# Altium schematic sheet pcuPWR.SchDoc
size A3
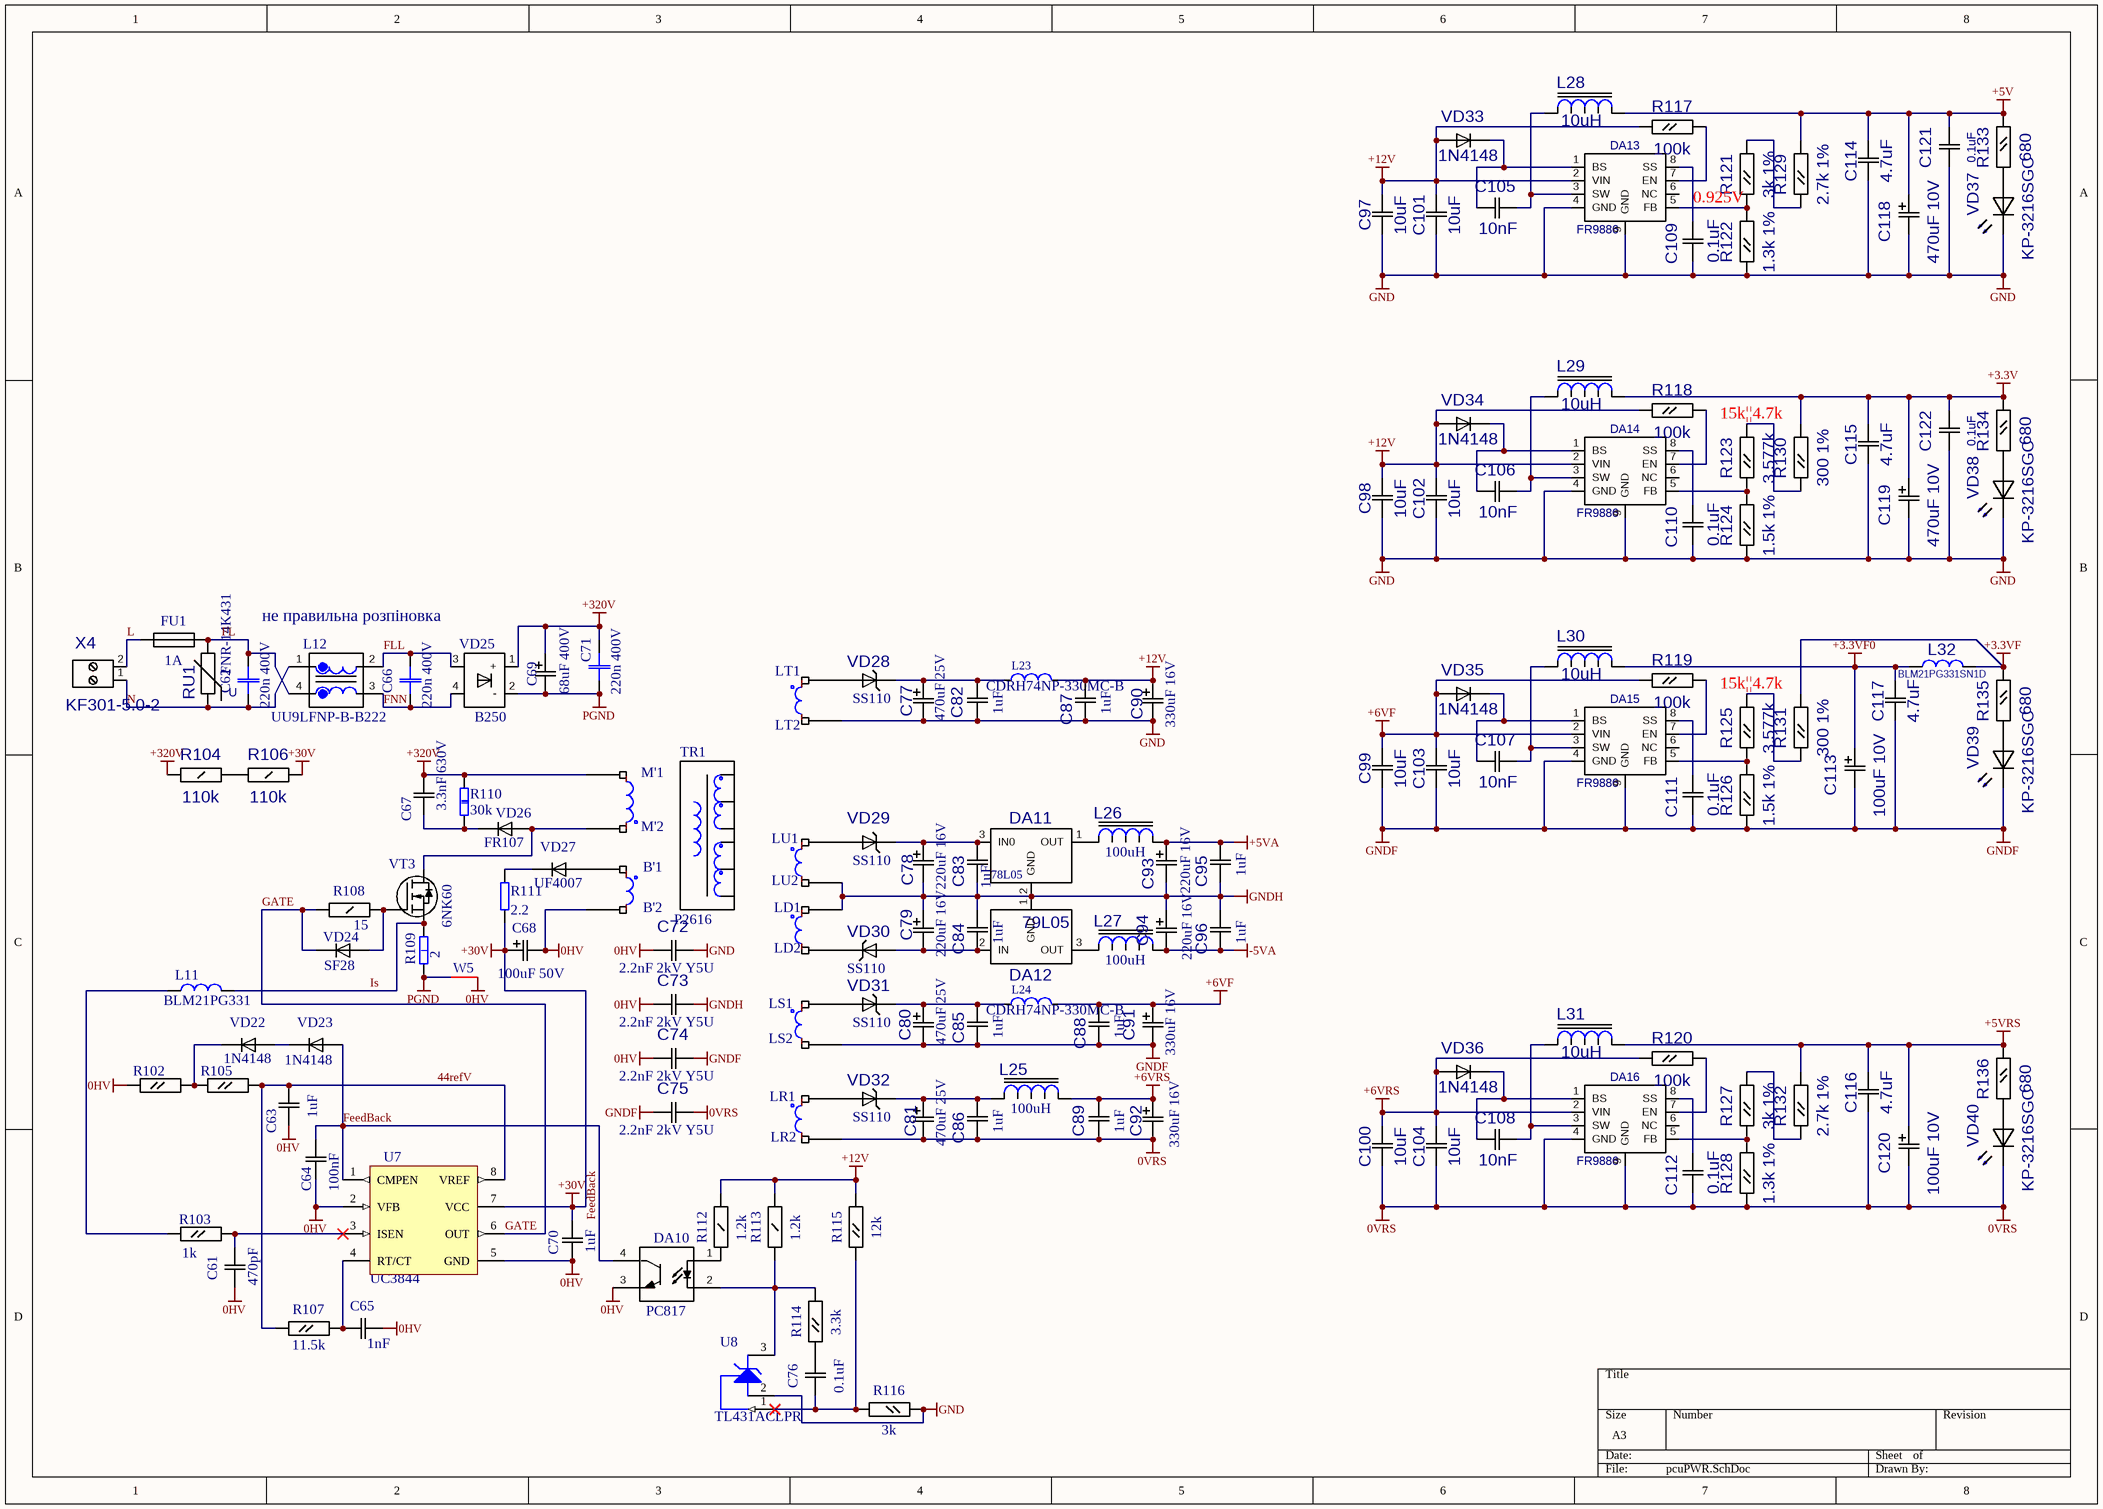
[diagram p0: pcuPWR.SchDoc]

## Parts
B'1  PCB_1R  [PCB_1R_BigOval]  (value not drawn)
B'2  PCB_1R  [PCB_1R_BigOval]  (value not drawn)
C61  value 470pF  [C0805]  (hidden comment: C0805)
C62  220n 400V  [MKP 18x7 h14 R15.24]
C63  value 1uF  [C0805]  (hidden comment: C0805)
C64  value 100nF  [C0805]  (hidden comment: C0805)
C65  value 1nF  [C0805]  (hidden comment: C0805)
C66  220n 400V  [MKP 18x7 h14 R15.24]
C67  3.3nF 630V  [Cer-Disk-d12.5-R7.62]
C68  value 100uF 50V  [El-d8-h12-F3.81]  (hidden comment: Cap El)
C69  value 68uF 400V  [El-d18-h36-F7.62]  (hidden comment: Cap El)
C70  value 1uF  [C0805]  (hidden comment: C0805)
C71  220n 400V  [MKP 18x7 h14 R15.24]
C72  2.2nF 2kV Y5U  [Cap-Disk-d8.5-R5.08]
C73  2.2nF 2kV Y5U  [Cap-Disk-d8.5-R5.08]
C74  2.2nF 2kV Y5U  [Cap-Disk-d8.5-R5.08]
C75  2.2nF 2kV Y5U  [Cap-Disk-d8.5-R5.08]
C76  value 0.1uF  [C0805]  (hidden comment: C0805)
C77  value 470uF 25V  [El-d8-h12-F3.81]  (hidden comment: Cap El)
C78  value 220uF 16V  [El-d6.3-h13-F2.54]  (hidden comment: Cap El)
C79  value 220uF 16V  [El-d6.3-h13-F2.54]  (hidden comment: Cap El)
C80  value 470uF 25V  [El-d8-h12-F3.81]  (hidden comment: Cap El)
C81  value 470uF 25V  [El-d8-h12-F3.81]  (hidden comment: Cap El)
C82  value 1uF  [C0805]  (hidden comment: C0805)
C83  value 1uF  [C0805]  (hidden comment: C0805)
C84  value 1uF  [C0805]  (hidden comment: C0805)
C85  value 1uF  [C0805]  (hidden comment: C0805)
C86  value 1uF  [C0805]  (hidden comment: C0805)
C87  value 1uF  [C0805]  (hidden comment: C0805)
C88  value 1uF  [C0805]  (hidden comment: C0805)
C89  value 1uF  [C0805]  (hidden comment: C0805)
C90  value 330uF 16V  [El-d8-h12-F3.81]  (hidden comment: Cap El)
C91  value 330uF 16V  [El-d8-h12-F3.81]  (hidden comment: Cap El)
C92  value 330uF 16V  [El-d8-h12-F3.81]  (hidden comment: Cap El)
C93  value 220uF 16V  [El-d6.3-h13-F2.54]  (hidden comment: Cap El)
C94  value 220uF 16V  [El-d6.3-h13-F2.54]  (hidden comment: Cap El)
C95  value 1uF  [C0805]  (hidden comment: C0805)
C96  value 1uF  [C0805]  (hidden comment: C0805)
C97  value 10uF  [C1206]  (hidden comment: C1206)
C98  value 10uF  [C1206]  (hidden comment: C1206)
C99  value 10uF  [C1206]  (hidden comment: C1206)
C100  value 10uF  [C1206]  (hidden comment: C1206)
C101  value 10uF  [C1206]  (hidden comment: C1206)
C102  value 10uF  [C1206]  (hidden comment: C1206)
C103  value 10uF  [C1206]  (hidden comment: C1206)
C104  value 10uF  [C1206]  (hidden comment: C1206)
C105  value 10nF  [C0805]  (hidden comment: C0805)
C106  value 10nF  [C0805]  (hidden comment: C0805)
C107  value 10nF  [C0805]  (hidden comment: C0805)
C108  value 10nF  [C0805]  (hidden comment: C0805)
C109  value 0.1uF  [C0805]  (hidden comment: C0805)
C110  value 0.1uF  [C0805]  (hidden comment: C0805)
C111  value 0.1uF  [C0805]  (hidden comment: C0805)
C112  value 0.1uF  [C0805]  (hidden comment: C0805)
C113  value 100uF 10V  [El-d5-h11-F2.54]  (hidden comment: Cap El)
C114  value 4.7uF  [C1206]  (hidden comment: C1206)
C115  value 4.7uF  [C1206]  (hidden comment: C1206)
C116  value 4.7uF  [C1206]  (hidden comment: C1206)
C117  value 4.7uF  [C1206]  (hidden comment: C1206)
C118  value 470uF 10V  [El-d8-h12-F3.81]  (hidden comment: Cap El)
C119  value 470uF 10V  [El-d8-h12-F3.81]  (hidden comment: Cap El)
C120  value 100uF 10V  [El-d5-h11-F2.54]  (hidden comment: Cap El)
C121  value 0.1uF  [C0805]  (hidden comment: C0805)
C122  value 0.1uF  [C0805]  (hidden comment: C0805)
DA10  PC817  [DIL4-300a]
DA11  78L05  [TO-92 - 1-2-3]
DA12  79L05  [TO-92 - 1-2-3]
DA13  FR9886  [SO8TP]
DA14  FR9886  [SO8TP]
DA15  FR9886  [SO8TP]
DA16  FR9886  [SO8TP]
FU1  value 1A  [FU_5x15]  (hidden comment: FUSE-D5)
L11  BLM21PG331  [R0805]
L12  UU9LFNP-B-B222  [UU9LF]
L23  CDRH74NP-330MC-B  [Dr-DRH-74]
L24  CDRH74NP-330MC-B  [Dr-DRH-74]
L25  100uH  [CD54]
L26  100uH  [CD54]
L27  100uH  [CD54]
L28  10uH  [CD32]
L29  10uH  [CD32]
L30  10uH  [CD32]
L31  10uH  [CD32]
L32  BLM21PG331SN1D  [R0805]
LD1  PCB_1R  [PCB_1R_BigOval]  (value not drawn)
LD2  PCB_1R  [PCB_1R_BigOval]  (value not drawn)
LR1  PCB_1R  [PCB_1R_BigOval]  (value not drawn)
LR2  PCB_1R  [PCB_1R_BigOval]  (value not drawn)
LS1  PCB_1R  [PCB_1R_BigOval]  (value not drawn)
LS2  PCB_1R  [PCB_1R_BigOval]  (value not drawn)
LT1  PCB_1R  [PCB_1R_BigOval]  (value not drawn)
LT2  PCB_1R  [PCB_1R_BigOval]  (value not drawn)
LU1  PCB_1R  [PCB_1R_BigOval]  (value not drawn)
LU2  PCB_1R  [PCB_1R_BigOval]  (value not drawn)
M'1  PCB_1R  [PCB_1R_BigOval]  (value not drawn)
M'2  PCB_1R  [PCB_1R_BigOval]  (value not drawn)
R102  R0805  [R0805]  (value not drawn)
R103  value 1k  [R0805]  (hidden comment: R0805)
R104  value 110k  [R1206]  (hidden comment: R1206)
R105  R0805  [R0805]  (value not drawn)
R106  value 110k  [R1206]  (hidden comment: R1206)
R107  value 11.5k  [R0805]  (hidden comment: R0805)
R108  value 15  [R1206]  (hidden comment: R1206)
R109  2  [R1W CF-500]
R110  30k  [R3W MO-700]
R111  2.2  [R0.25-300]
R112  value 1.2k  [R1206]  (hidden comment: R1206)
R113  value 1.2k  [R1206]  (hidden comment: R1206)
R114  value 3.3k  [R0805]  (hidden comment: R0805)
R115  value 12k  [R0805]  (hidden comment: R0805)
R116  value 3k  [R0805]  (hidden comment: R0805)
R117  value 100k  [R0805]  (hidden comment: R0805)
R118  value 100k  [R0805]  (hidden comment: R0805)
R119  value 100k  [R0805]  (hidden comment: R0805)
R120  value 100k  [R0805]  (hidden comment: R0805)
R121  value 3k 1%  [R0805]  (hidden comment: R0805)
R122  value 1.3k 1%  [R0805]  (hidden comment: R0805)
R123  value 3.577k  [R0805]  (hidden comment: R0805)
R124  value 1.5k 1%  [R0805]  (hidden comment: R0805)
R125  value 3.577k  [R0805]  (hidden comment: R0805)
R126  value 1.5k 1%  [R0805]  (hidden comment: R0805)
R127  value 3k 1%  [R0805]  (hidden comment: R0805)
R128  value 1.3k 1%  [R0805]  (hidden comment: R0805)
R129  value 2.7k 1%  [R0805]  (hidden comment: R0805)
R130  value 300 1%  [R0805]  (hidden comment: R0805)
R131  value 300 1%  [R0805]  (hidden comment: R0805)
R132  value 2.7k 1%  [R0805]  (hidden comment: R0805)
R133  value 680  [R0805]  (hidden comment: R0805)
R134  value 680  [R0805]  (hidden comment: R0805)
R135  value 680  [R0805]  (hidden comment: R0805)
R136  value 680  [R0805]  (hidden comment: R0805)
RU1  value FNR-14K431  [VAR_D15_t5]  (hidden comment: VAR593)
TR1  P2616  [P2616]
U7  UC3844  [SO8-1.27]
U8  TL431ACLPR  [TI-LP3]
VD22  value 1N4148  [SOD123]  (hidden comment: DIOD_thin)
VD23  value 1N4148  [SOD123]  (hidden comment: DIOD_thin)
VD24  value SF28  [DIOD_small_bigholes]  (hidden comment: DIOD)
VD25  B250  [CS30D]
VD26  value FR107  [DIOD_small_bigholes]  (hidden comment: DIOD)
VD27  value UF4007  [DIOD_small_bigholes]  (hidden comment: DIOD)
VD28  value SS110  [DO-214AC(SMA)]  (hidden comment: 10BQ100)
VD29  value SS110  [DO-214AC(SMA)]  (hidden comment: 10BQ100)
VD30  value SS110  [DO-214AC(SMA)]  (hidden comment: 10BQ100)
VD31  value SS110  [DO-214AC(SMA)]  (hidden comment: 10BQ100)
VD32  value SS110  [DO-214AC(SMA)]  (hidden comment: 10BQ100)
VD33  value 1N4148  [SOD123]  (hidden comment: DIOD_thin)
VD34  value 1N4148  [SOD123]  (hidden comment: DIOD_thin)
VD35  value 1N4148  [SOD123]  (hidden comment: DIOD_thin)
VD36  value 1N4148  [SOD123]  (hidden comment: DIOD_thin)
VD37  KP-3216SGC  [KP-3216]
VD38  KP-3216SGC  [KP-3216]
VD39  KP-3216SGC  [KP-3216]
VD40  KP-3216SGC  [KP-3216]
VT3  value 6NK60  [TO220-RB-600]  (hidden comment: IRF620)
W5  Net connector  [Net connector0.5mm]  (value not drawn)  (net tie, no BOM)
X4  KF301-5.0-2  [KF301-5.0-2]

## Nets
0HV: B'2.1 C61.1 C63.1 C64.1 C65.2 C68.2 C70.1 C72.1 C73.1 C74.1 DA10.3(E) R102.2 U7.2(VFB) U7.5(GND) W5.1
0VRS: C75.2 C81.2 C86.1 C89.1 C92.2 C100.1 C104.1 C112.1 C116.1 C120.2 DA16.4(GND) DA16.9(GND) LR2.1 R128.2 VD40.2
+3.3V: C115.2 C119.1 C122.2 L29.2 R130.1 R134.2
+3.3VF: L32.2 R131.1 R135.2
+3.3VF0: C113.1 C117.2 L30.2 L32.1
+5V: C114.2 C118.1 C121.2 L28.2 R129.1 R133.2
+5VA: C93.1 C95.2 L26.2
+5VRS: C116.2 C120.1 L31.2 R132.1 R136.2
+6VF: C88.2 C91.1 C99.2 C103.2 DA15.2(VIN) L24.2 R119.2 VD35.2(+)
+6VRS: C89.2 C92.1 C100.2 C104.2 DA16.2(VIN) L25.2 R120.2 VD36.2(+)
+12V: C87.2 C90.1 C97.2 C98.2 C101.2 C102.2 DA13.2(VIN) DA14.2(VIN) L23.2 R112.1 R113.1 R115.1 R117.2 R118.2 VD33.2(+) VD34.2(+)
+30V: C68.1 C70.2 R106.1 R111.1 U7.7(VCC)
+320V: C67.1 C69.1 C71.1 M'1.1 R104.2 R110.2 VD25.1(+)
-5VA: C94.2 C96.1 L27.2
GND: C72.2 C77.2 C82.1 C87.1 C90.2 C97.1 C98.1 C101.1 C102.1 C109.1 C110.1 C114.1 C115.1 C118.2 C119.2 C121.1 C122.1 DA13.4(GND) DA13.9(GND) DA14.4(GND) DA14.9(GND) LT2.1 R116.2 R122.2 R124.2 U8.2(ANODE) VD37.2 VD38.2
GNDF: C74.2 C75.1 C80.2 C85.1 C88.1 C91.2 C99.1 C103.1 C111.1 C113.2 C117.1 DA15.4(GND) DA15.9(GND) LS2.1 R126.2 VD39.2
GNDH: C73.2 C78.2 C79.1 C83.1 C84.2 C93.2 C94.1 C95.1 C96.2 DA11.2(GND) DA12.1(GND) LD1.1 LU2.1
PGND: C69.2 C71.2 R109.1 VD25.2(-) W5.2
44refV: C63.2 R105.1 R107.2 U7.8(VREF)
FeedBack: C64.2 DA10.4(C) U7.1(CMPEN) VD23.2(+)
FL: C62.1 FU1.2 L12.4 RU1.1
FLL: C66.1 L12.2 VD25.3
FNN: C66.2 L12.3 VD25.4
GATE: R108.2 U7.6(OUT) VD24.1(-)
Is: L11.2 R109.2 VT3.3(S)
L: FU1.1 X4.2
N: C62.2 L12.1 RU1.2 X4.1
NetB'1_1: B'1.1 VD27.2(+)
NetC61_2: C61.2 R103.1 U7.3(ISEN)
NetC65_1: C65.1 R107.1 U7.4(RT/CT)
NetC67_2: C67.2 R110.1 VD26.1(-)
NetC76_1: C76.1 R115.2 R116.1 U8.1(REF)
NetC76_2: C76.2 R114.2
NetC77_1: C77.1 C82.2 L23.1 VD28.1
NetC78_1: C78.1 C83.2 DA11.3(IN0) VD29.1
NetC79_2: C79.2 C84.1 DA12.2(IN) VD30.2
NetC80_1: C80.1 C85.2 L24.1 VD31.1
NetC81_1: C81.1 C86.2 L25.1 VD32.1
NetC105_1: C105.1 DA13.1(BS) VD33.1(-)
NetC105_2: C105.2 DA13.3(SW) L28.1
NetC106_1: C106.1 DA14.1(BS) VD34.1(-)
NetC106_2: C106.2 DA14.3(SW) L29.1
NetC107_1: C107.1 DA15.1(BS) VD35.1(-)
NetC107_2: C107.2 DA15.3(SW) L30.1
NetC108_1: C108.1 DA16.1(BS) VD36.1(-)
NetC108_2: C108.2 DA16.3(SW) L31.1
NetC109_2: C109.2 DA13.8(SS)
NetC110_2: C110.2 DA14.8(SS)
NetC111_2: C111.2 DA15.8(SS)
NetC112_2: C112.2 DA16.8(SS)
NetDA10_1: DA10.1(+) R112.2
NetDA10_2: DA10.2(-) R113.2 R114.1 U8.3(CATHODE)
NetDA11_1: DA11.1(OUT) L26.1
NetDA12_3: DA12.3(OUT) L27.1
NetDA13_5: DA13.5(FB) R121.2 R122.1
NetDA13_7: DA13.7(EN) R117.1
NetDA14_5: DA14.5(FB) R123.2 R124.1
NetDA14_7: DA14.7(EN) R118.1
NetDA15_5: DA15.5(FB) R125.2 R126.1
NetDA15_7: DA15.7(EN) R119.1
NetDA16_5: DA16.5(FB) R127.2 R128.1
NetDA16_7: DA16.7(EN) R120.1
NetL11_1: L11.1 R103.2
NetLD2_1: LD2.1 VD30.1
NetLR1_1: LR1.1 VD32.2
NetLS1_1: LS1.1 VD31.2
NetLT1_1: LT1.1 VD28.2
NetLU1_1: LU1.1 VD29.2
NetM'2_1: M'2.1 VD26.2(+) VT3.2(D)
NetR102_1: R102.1 R105.2 VD22.1(-)
NetR104_1: R104.1 R106.2
NetR108_1: R108.1 VD24.2(+) VT3.1(G)
NetR111_2: R111.2 VD27.1(-)
NetR121_1: R121.1 R129.2
NetR123_1: R123.1 R130.2
NetR125_1: R125.1 R131.2
NetR127_1: R127.1 R132.2
NetR133_1: R133.1 VD37.1
NetR134_1: R134.1 VD38.1
NetR135_1: R135.1 VD39.1
NetR136_1: R136.1 VD40.1
NetVD22_2: VD22.2(+) VD23.1(-)

Not connected (* = marked no-connect by the designer): DA13 6(NC); DA14 6(NC); DA15 6(NC); DA16 6(NC)

## Notes on the sheet
- (near R121) 0.925V
- 15k||4.7k
- не правильна розпіновка
- (in symbol VARISTOR_D15) U

## Library data of the parts
C61 C63-C65 C70 C76 C82-C89 C95 C96 C121 C122 = C0805: RefDes2: {RefDes2}
C62 C66 C71 = MKS4 220n 400V: Value: 220n 400V
C67 C72-C75 = Cap: CBB21; RefDes2: {RefDes2}
C68 C69 C77-C81 C90-C94 C113 C118-C120 = Cap El: RefDes2: {RefDes2}
C97-C104 C114-C117 = C1206: RefDes2: {RefDes2}
DA10 = PC817: optocuple; Value: PC817
DA11 = MC78LXX: RefDes2: {RefDes2}; Value: {Value}
DA12 = 79L05: RefDes2: {RefDes2}; Value: {Value}
DA13-DA16 = FR9886: 23V, 2A, 380KHz Synchronous Step-Down  DC/DC Converter; Value: {Value}
FU1 = FUSE-D5: Fuse; RefDes2: {RefDes2}
L11 L32 = BLM21PG331SN1D: Ferrite beads
  L11: Value: BLM21PG331
  L32: Value: BLM21PG331SN1D
L12 = UU9LF: AC COMMON MODE COIL; Value: *
L23 L24 = L-DRH-74 33uH: 1.05A 0.17ohm; Value: CDRH74NP-330MC-B
L25-L27 = CD54: SMD Power Inductor  L×W×H: 6.1×5.5×4.85mm Max.; RefDes2: {RefDes2}; Value: 100uH
L28-L31 = CD32: SMD Power Inductor LxWxH: 3.5x3.1x2.5mm Max; RefDes2: {RefDes2}; Value: 10uH
R102 R103 R105 R107 R114-R116 R121-R136 = R0805: RefDes2: {RefDes2}
R104 R106 R108 R112 R113 = R1206: RefDes2: {RefDes2}
R109 = R-1W CF: 1W 5% 500V; Price: 0.053; Value: 2
R110 = R-3W MO: 3W 5% 500V; Value: 30k
R111 = R-0.25W: 0.25W 5% 250V; Value: 2.2
RU1 = VARISTOR_D15: RefDes2: {RefDes2}
TR1 = P2616: transformer
U7 = UC3844: Current-Mode PWM Controller
U8 = TL431ACLPR: Adjustable Precision Shunt Regulator, 34 ppm / degC, 100 mA, 0 to 70 degC, 3-pin TO-92 (LP), Pb-Free (RoHS); Manufacturer: Texas Instruments; Initial Accuracy @ 25/deg C(%): 1; Iout/Iz(Max)(mA): 100; Min Iz for Regulation(uA): 600; Rating: Catalog; SubFamily: Shunt Voltage Reference; Temp Coeff(Max)(ppm/ degree C): 92; Temp Coeff(Typ)(ppm/ degree C): 34; VO Adj(Max)(V): 36; VO Adj(Min)(V): 2.495; DatasheetVersion: SLVS543M; PackageVersion: 4040001-2/C; PackageReference: LP3; PackageDescription: Plastic Cylindrical Package, Formed Lead Option (TO-92); Supplier 1: Digi-Key; Supplier Part Number 1: 296-1287-2-ND; Supplier 2: Digi-Key; Supplier Part Number 2: 296-1287-1-ND; Supplier 3: Digi-Key; Supplier Part Number 3: 296-1287-6-ND; Supplier 4: Newark; Supplier Part Number 4: 35C2183; Supplier 5: Mouser; Supplier Part Number 5: 595-TL431ACLPR; Eco-Plan: Pb-Free (RoHS); Mounting Technology: Through Hole; Code_JEDEC: TO-226; PartNumber: TL431ACLPR; ComponentLink1Description: Manufacturer URL; ComponentLink1URL: http://www.ti.com/; ComponentLink2Description: Datasheet; ComponentLink2URL: http://www.ti.com/general/docs/lit/getliterature.tsp?genericPartNumber=TL431A&fileType=pdf; ComponentLink3Description: Package Specification; ComponentLink3URL: http://www.ti.com/litv/pdf/msot002a
VD22 VD23 VD33-VD36 = DIOD_thin: DIOD 1N4148; RefDes2: {RefDes2}
VD24 VD26 VD27 = DIOD: RefDes2: {RefDes2}
VD25 = B250: RefDes2: {RefDes2}; Value: *
VD28-VD32 = 10BQ100: RefDes2: {RefDes2}
VD37-VD40 = KP-3216SGC: RefDes2: {RefDes2}
VT3 = MOSFET_N: N-Channel MOSFET
X4 = KF301-5.0-2: 5mm 2pins; RefDes2: {RefDes2}